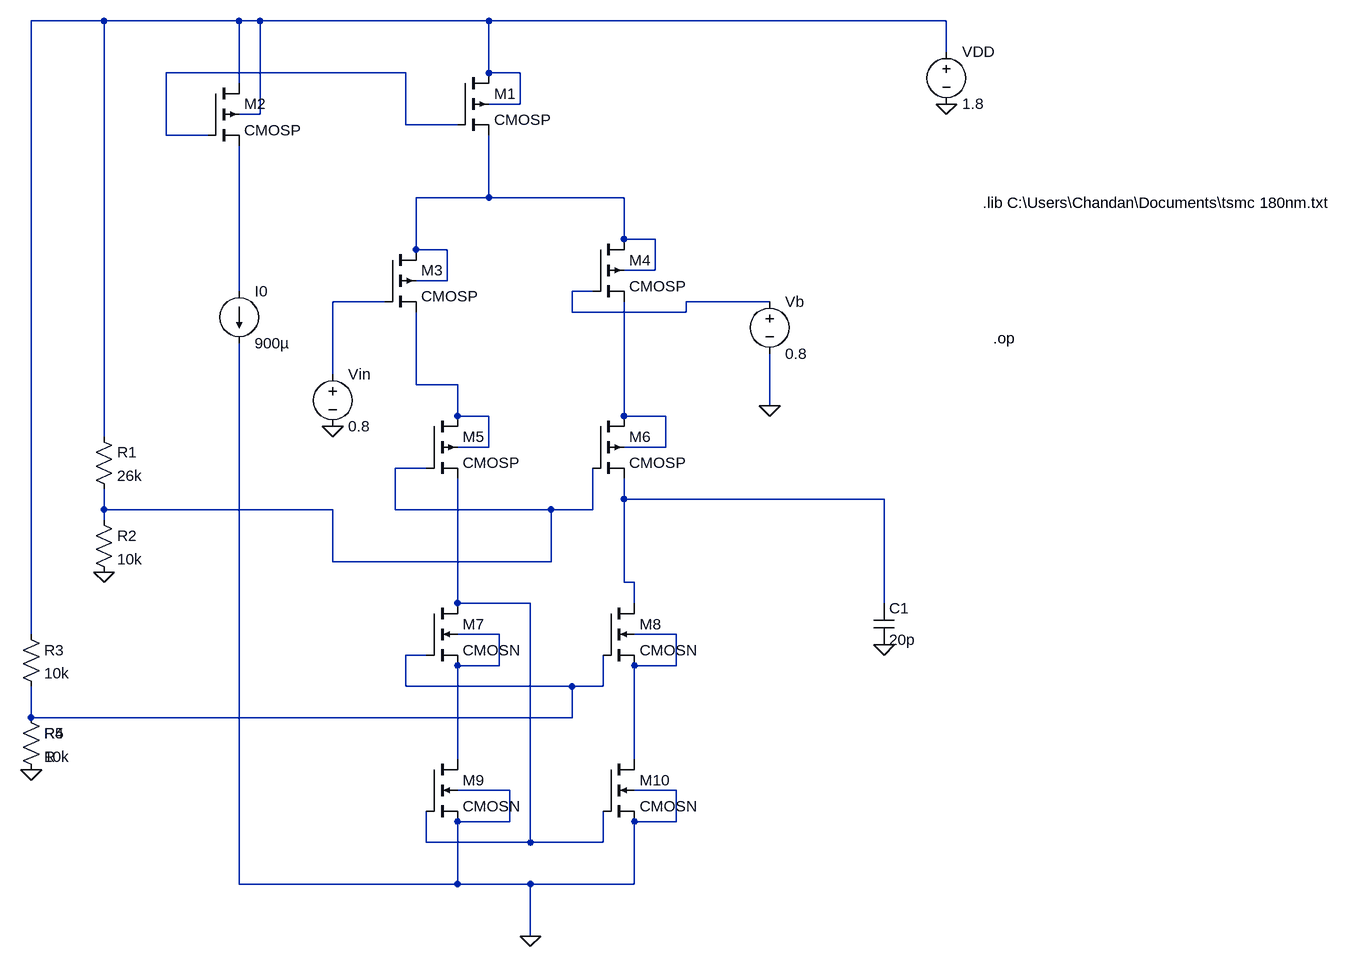
[diagram p0: schematic Draft1.asc]
Draft1.asc, the LTspice schematic file:
Version 4
SHEET 1 2948 2132
WIRE 896 -528 784 -528
WIRE 1104 -528 896 -528
WIRE 1136 -528 1104 -528
WIRE 1488 -528 1136 -528
WIRE 2192 -528 1488 -528
WIRE 2192 -480 2192 -528
WIRE 1360 -448 992 -448
WIRE 1488 -448 1488 -528
WIRE 1536 -448 1488 -448
WIRE 1104 -432 1104 -528
WIRE 1536 -400 1536 -448
WIRE 1536 -400 1488 -400
WIRE 1136 -384 1136 -528
WIRE 1136 -384 1104 -384
WIRE 1360 -368 1360 -448
WIRE 1440 -368 1360 -368
WIRE 992 -352 992 -448
WIRE 1056 -352 992 -352
WIRE 1488 -256 1488 -352
WIRE 1488 -256 1376 -256
WIRE 1696 -256 1488 -256
WIRE 1696 -192 1696 -256
WIRE 1744 -192 1696 -192
WIRE 1376 -176 1376 -256
WIRE 1424 -176 1376 -176
WIRE 1744 -144 1744 -192
WIRE 1744 -144 1696 -144
WIRE 1424 -128 1424 -176
WIRE 1424 -128 1376 -128
WIRE 1104 -112 1104 -336
WIRE 1648 -112 1616 -112
WIRE 1328 -96 1248 -96
WIRE 1920 -96 1792 -96
WIRE 1616 -80 1616 -112
WIRE 1792 -80 1792 -96
WIRE 1792 -80 1616 -80
WIRE 1248 16 1248 -96
WIRE 1376 32 1376 -80
WIRE 1440 32 1376 32
WIRE 1920 64 1920 -16
WIRE 1440 80 1440 32
WIRE 1488 80 1440 80
WIRE 1696 80 1696 -96
WIRE 1760 80 1696 80
WIRE 896 112 896 -528
WIRE 1488 128 1488 80
WIRE 1488 128 1440 128
WIRE 1760 128 1760 80
WIRE 1760 128 1696 128
WIRE 1392 160 1344 160
WIRE 1696 208 1696 176
WIRE 2096 208 1696 208
WIRE 896 224 896 192
WIRE 1248 224 896 224
WIRE 1344 224 1344 160
WIRE 1584 224 1344 224
WIRE 1648 224 1648 160
WIRE 1648 224 1584 224
WIRE 896 240 896 224
WIRE 1248 304 1248 224
WIRE 1584 304 1584 224
WIRE 1584 304 1248 304
WIRE 1696 336 1696 208
WIRE 1712 336 1696 336
WIRE 1440 368 1440 176
WIRE 1552 368 1440 368
WIRE 1712 368 1712 336
WIRE 2096 368 2096 208
WIRE 784 416 784 -528
WIRE 1504 416 1440 416
WIRE 1776 416 1712 416
WIRE 1392 448 1360 448
WIRE 1504 464 1504 416
WIRE 1504 464 1440 464
WIRE 1776 464 1776 416
WIRE 1776 464 1712 464
WIRE 1360 496 1360 448
WIRE 1616 496 1360 496
WIRE 1664 496 1664 448
WIRE 1664 496 1616 496
WIRE 784 544 784 496
WIRE 1616 544 1616 496
WIRE 1616 544 784 544
WIRE 1440 608 1440 464
WIRE 1712 608 1712 464
WIRE 1520 656 1440 656
WIRE 1776 656 1712 656
WIRE 1520 704 1520 656
WIRE 1520 704 1440 704
WIRE 1776 704 1776 656
WIRE 1776 704 1712 704
WIRE 1392 736 1392 688
WIRE 1552 736 1552 368
WIRE 1552 736 1392 736
WIRE 1664 736 1664 688
WIRE 1664 736 1552 736
WIRE 1104 800 1104 -32
WIRE 1440 800 1440 704
WIRE 1440 800 1104 800
WIRE 1552 800 1440 800
WIRE 1712 800 1712 704
WIRE 1712 800 1552 800
WIRE 1552 880 1552 800
FLAG 2192 -400 0
FLAG 1552 880 0
FLAG 1248 96 0
FLAG 1920 64 0
FLAG 896 320 0
FLAG 784 624 0
FLAG 2096 432 0
SYMBOL pmos4 1440 -448 R0
SYMATTR InstName M1
SYMATTR Value CMOSP
SYMATTR Value2 l=1u w=1000u
SYMBOL voltage 2192 -496 R0
WINDOW 123 0 0 Left 0
WINDOW 39 0 0 Left 0
SYMATTR InstName VDD
SYMATTR Value 1.8
SYMBOL pmos4 1056 -432 R0
SYMATTR InstName M2
SYMATTR Value CMOSP
SYMATTR Value2 l=1u w=1000u
SYMBOL pmos4 1328 -176 R0
SYMATTR InstName M3
SYMATTR Value CMOSP
SYMATTR Value2 l=1u w=500u
SYMBOL pmos4 1648 -192 R0
SYMATTR InstName M4
SYMATTR Value CMOSP
SYMATTR Value2 l=1u w=500u
SYMBOL pmos4 1392 80 R0
SYMATTR InstName M5
SYMATTR Value CMOSP
SYMATTR Value2 l=1u w=500u
SYMBOL pmos4 1648 80 R0
SYMATTR InstName M6
SYMATTR Value CMOSP
SYMATTR Value2 l=1u w=500u
SYMBOL nmos4 1392 368 R0
SYMATTR InstName M7
SYMATTR Value CMOSN
SYMATTR Value2 l=1u w=1000u
SYMBOL nmos4 1664 368 R0
SYMATTR InstName M8
SYMATTR Value CMOSN
SYMATTR Value2 l=1u w=1000u
SYMBOL nmos4 1392 608 R0
SYMATTR InstName M9
SYMATTR Value CMOSN
SYMATTR Value2 l=1u w=1000u
SYMBOL nmos4 1664 608 R0
SYMATTR InstName M10
SYMATTR Value CMOSN
SYMATTR Value2 l=1u w=1000u
SYMBOL current 1104 -112 R0
WINDOW 123 0 0 Left 0
WINDOW 39 0 0 Left 0
SYMATTR InstName I0
SYMATTR Value 900µ
SYMBOL voltage 1248 0 R0
WINDOW 123 0 0 Left 0
WINDOW 39 0 0 Left 0
SYMATTR InstName Vin
SYMATTR Value 0.8
SYMBOL voltage 1920 -112 R0
WINDOW 123 0 0 Left 0
WINDOW 39 0 0 Left 0
SYMATTR InstName Vb
SYMATTR Value 0.8
SYMBOL res 880 96 R0
SYMATTR InstName R1
SYMATTR Value 26k
SYMBOL res 880 224 R0
SYMATTR InstName R2
SYMATTR Value 10k
SYMBOL res 768 400 R0
SYMATTR InstName R3
SYMATTR Value 10k
SYMBOL res 768 528 R0
SYMATTR InstName R4
SYMATTR Value 10k
SYMBOL res 768 528 R0
SYMATTR InstName R5
SYMBOL cap 2080 368 R0
SYMATTR InstName C1
SYMATTR Value 20p
TEXT 2264 -40 Left 2 !.op
TEXT 2248 -248 Left 2 !.lib C:\\Users\\Chandan\\Documents\\tsmc 180nm.txt

The netlist it stands for:
* Draft1.asc
M1 N001 N002 N003 N001 CMOSP l=1u w=1000u
VDD N001 0 1.8
M2 N001 N002 N004 N001 CMOSP l=1u w=1000u
M3 N003 N006 N007 N003 CMOSP l=1u w=500u
M4 N003 N005 N008 N003 CMOSP l=1u w=500u
M5 N007 N009 N011 N007 CMOSP l=1u w=500u
M6 N008 N009 N010 N008 CMOSP l=1u w=500u
M7 N011 N014 N012 N012 CMOSN l=1u w=1000u
M8 N010 N014 N013 N013 CMOSN l=1u w=1000u
M9 N012 N011 0 0 CMOSN l=1u w=1000u
M10 N013 N011 0 0 CMOSN l=1u w=1000u
I0 N004 0 900µ
Vin N006 0 0.8
Vb N005 0 0.8
R1 N001 N009 26k
R2 N009 0 10k
R3 N001 N014 10k
R4 N014 0 10k
R5 N014 0 R
C1 N010 0 20p
.model NMOS NMOS
.model PMOS PMOS
.lib standard.mos
.op
.lib C:\Users\Chandan\Documents\tsmc 180nm.txt
.backanno
.end